# EAGLE schematic untitled (EAGLE 7.2.0)
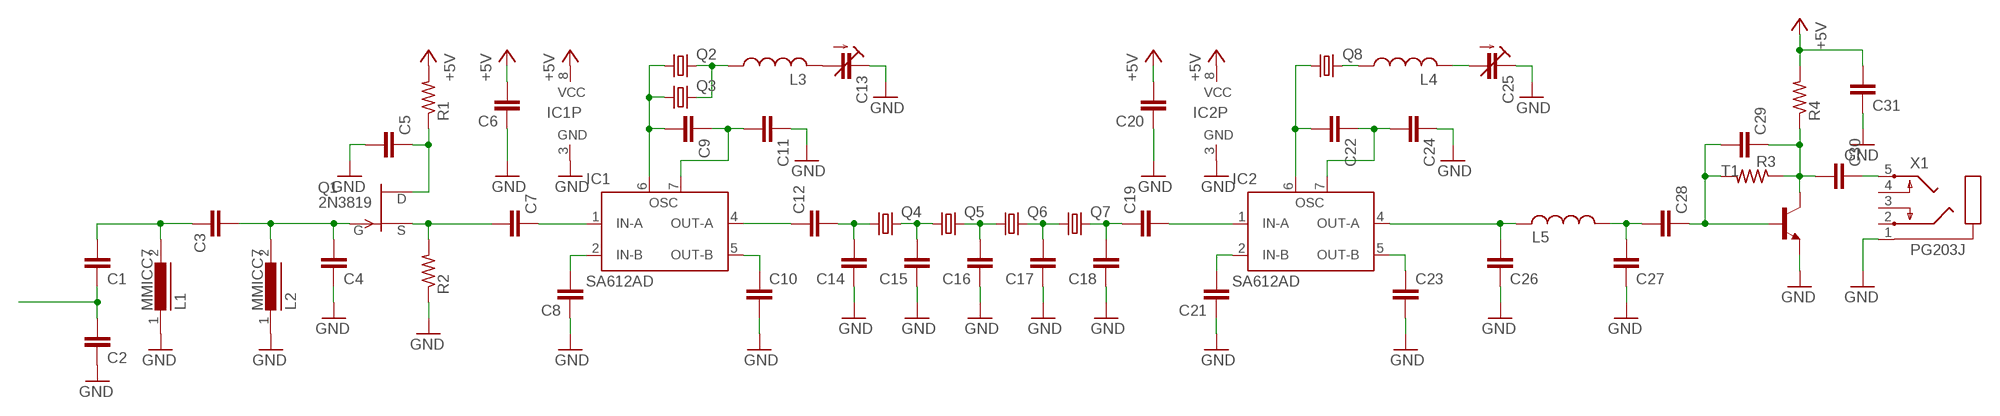
[diagram p0: schematic, sheet 1]

## Parts
C1  C-EUC0805K  [C0805K]
C2  C-EUC0805K  [C0805K]
C3  C-EUC0805K  [C0805K]
C4  C-EUC0805K  [C0805K]
C5  C-EUC0805K  [C0805K]
C6  C-EUC0805K  [C0805K]
C7  C-EUC0805K  [C0805K]
C8  C-EUC0805K  [C0805K]
C9  C-EUC0805K  [C0805K]
C10  C-EUC0805K  [C0805K]
C11  C-EUC0805K  [C0805K]
C12  C-EUC0805K  [C0805K]
C13  C-TRIMMTZ03  [CTRIMTZ03]
C14  C-EUC0805K  [C0805K]
C15  C-EUC0805K  [C0805K]
C16  C-EUC0805K  [C0805K]
C17  C-EUC0805K  [C0805K]
C18  C-EUC0805K  [C0805K]
C19  C-EUC0805K  [C0805K]
C20  C-EUC0805K  [C0805K]
C21  C-EUC0805K  [C0805K]
C22  C-EUC0805K  [C0805K]
C23  C-EUC0805K  [C0805K]
C24  C-EUC0805K  [C0805K]
C25  C-TRIMMTZ03  [CTRIMTZ03]
C26  C-EUC0805K  [C0805K]
C27  C-EUC0805K  [C0805K]
C28  C-EUC0805K  [C0805K]
C29  C-EUC0805K  [C0805K]
C30  C-EUC0805K  [C0805K]
C31  C-EUC0805K  [C0805K]
IC1  SA612AD  [SO08]
IC2  SA612AD  [SO08]
L1  MMICC7  [MMICC7]
L2  MMICC7  [MMICC7]
L3  L-US0204/7  [0204/7]
L4  L-US0204/7  [0204/7]
L5  L-US0204/7  [0204/7]
Q1  2N3819  [TO92]
Q2  CRYSTALHC49S  [HC49/S]
Q3  CRYSTALHC49S  [HC49/S]
Q4  CRYSTALHC49S  [HC49/S]
Q5  CRYSTALHC49S  [HC49/S]
Q6  CRYSTALHC49S  [HC49/S]
Q7  CRYSTALHC49S  [HC49/S]
Q8  CRYSTALHC49S  [HC49/S]
R1  R-US_R0805  [R0805]
R2  R-US_R0805  [R0805]
R3  R-US_R0805  [R0805]
R4  R-US_R0805  [R0805]
T1  MMBT3904LT1-NPN-SOT23-BEC  [SOT23-BEC]
X1  PG203J  [PG203J]

## Nets
+5V: C6.2 C20.2 C31.2 IC1.8(VCC) IC2.8(VCC) R1.2 R4.2
GND: C2.1 C4.1 C5.2 C6.1 C8.1 C10.2 C11.1 C13.1(E) C14.1 C15.1 C16.1 C17.1 C18.1 C20.1 C21.1 C23.2 C24.1 C25.1(E) C26.1 C27.1 C31.1 IC1.3(GND) IC2.3(GND) L1.1 L2.1 R2.1 T1.E X1.1
N$1: C10.1 IC1.5(OUT-B)
N$2: C19.2 IC2.1(IN-A)
N$3: C7.1 IC1.1(IN-A)
N$4: C12.1 IC1.4(OUT-A)
N$5: C30.1 X1.5
N$6: C29.1 C30.2 R3.1 R4.1 T1.C
N$7: C28.1 C29.2 R3.2 T1.B
N$8: C27.2 C28.2 L5.1
N$9: C26.2 IC2.4(OUT-A) L5.2
N$10: C9.2 IC1.6(OSC) Q2.1 Q3.1
N$11: L3.1 Q2.2 Q3.2
N$12: C13.2(A) L3.2
N$13: C9.1 C11.2 IC1.7(OSC')
N$14: C8.2 IC1.2(IN-B)
N$15: C1.1 C2.2
N$19: C12.2 C14.2 Q4.1
N$20: C15.2 Q4.2 Q5.1
N$21: C16.2 Q5.2 Q6.1
N$22: C17.2 Q6.2 Q7.1
N$23: C18.2 C19.1 Q7.2
N$24: C23.1 IC2.5(OUT-B)
N$26: C22.2 IC2.6(OSC) Q8.1
N$27: L4.1 Q8.2
N$28: C25.2(A) L4.2
N$29: C22.1 C24.2 IC2.7(OSC')
N$33: C21.2 IC2.2(IN-B)
N$34: C7.2 Q1.3(S) R2.2
N$35: C5.1 Q1.1(D) R1.1
N$36: C3.2 C4.2 L2.2 Q1.2(G)
N$37: C1.2 C3.1 L1.2
Unconnected: X1.2 X1.3 X1.4

## Library data of the parts
C1-C12 C14-C24 C26-C31 = rcl:C-EU: CAPACITOR, European symbol
C13 C25 = rcl:C-TRIMM: Trimm capacitor
IC1 IC2 = linear:SA612A: Double-balanced mixer and oscillator NE612/SA612 Source: www-eu2.semiconductors.philips.com/acrobat/datasheets/SA612A.pdf
L1 L2 = inductors:MMICC7: INDUCTOR
L3-L5 = rcl:L-US: INDUCTOR, American symbol
Q1 = transistor-fet:2N3819: N-Channel Junction FET
Q2-Q8 = crystal:CRYSTAL: CRYSTAL; OC_FARNELL: 1667008; OC_NEWARK: unknown
R1-R4 = rcl:R-US_: RESISTOR, American symbol
T1 = transistor-neu-to92:*-NPN-: NPN Transistror
X1 = con-hirschmann:PG203J: MIC/HEADPHONE JACK KS-S stereo microphone/headphone jack PG203JN (Schukat); OC_FARNELL: unknown; OC_NEWARK: unknown